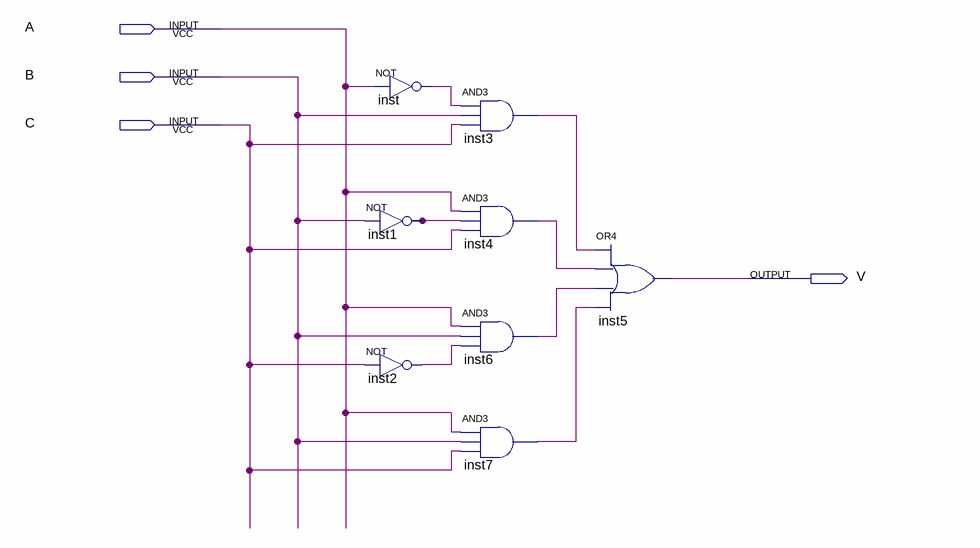
[diagram p0: schematic sheet]
// Quartus schematic majority.bdf as structural Verilog: 8 symbols, 4 pins
module majority (
  input  A,
  input  B,
  input  C,
  output V
);

  wire inst1_out, inst2_out, inst3_out, inst4_out, inst6_out, inst7_out, inst_out;

  not inst (inst_out, A);
  not inst1 (inst1_out, B);
  not inst2 (inst2_out, C);
  and inst3 (inst3_out, inst_out, B, C);
  and inst4 (inst4_out, A, inst1_out, C);
  and inst6 (inst6_out, A, B, inst2_out);
  and inst7 (inst7_out, A, B, C);
  or inst5 (V, inst3_out, inst4_out, inst6_out, inst7_out);
endmodule
